# Altium schematic sheet QSFP.SchDoc: =ProjectName
size 420 x 297 mm; Author: T.P.; CompanyName: WUT; DrawnBy: T.P.; Organization: WUT ISE; Address1: Warsaw Univeristy of Technology; Address2: Nowowiejska 15/19; DocumentNumber: 20; Revision: 0.9; SheetNumber: 20; SheetTotal: 36; EDA_Number: ARTIQ; Projet: ARTIQ/SINARA; ModifiedBy: -; CreateDate: XX/XX/XXXX; CheckedDate: -; Title2: QSFP.SchDoc; DivGrp: ISE; Designer: G.K. and T.P.; ModifiedDate: -; ProjectName: ADC/DAC MEZZANINE
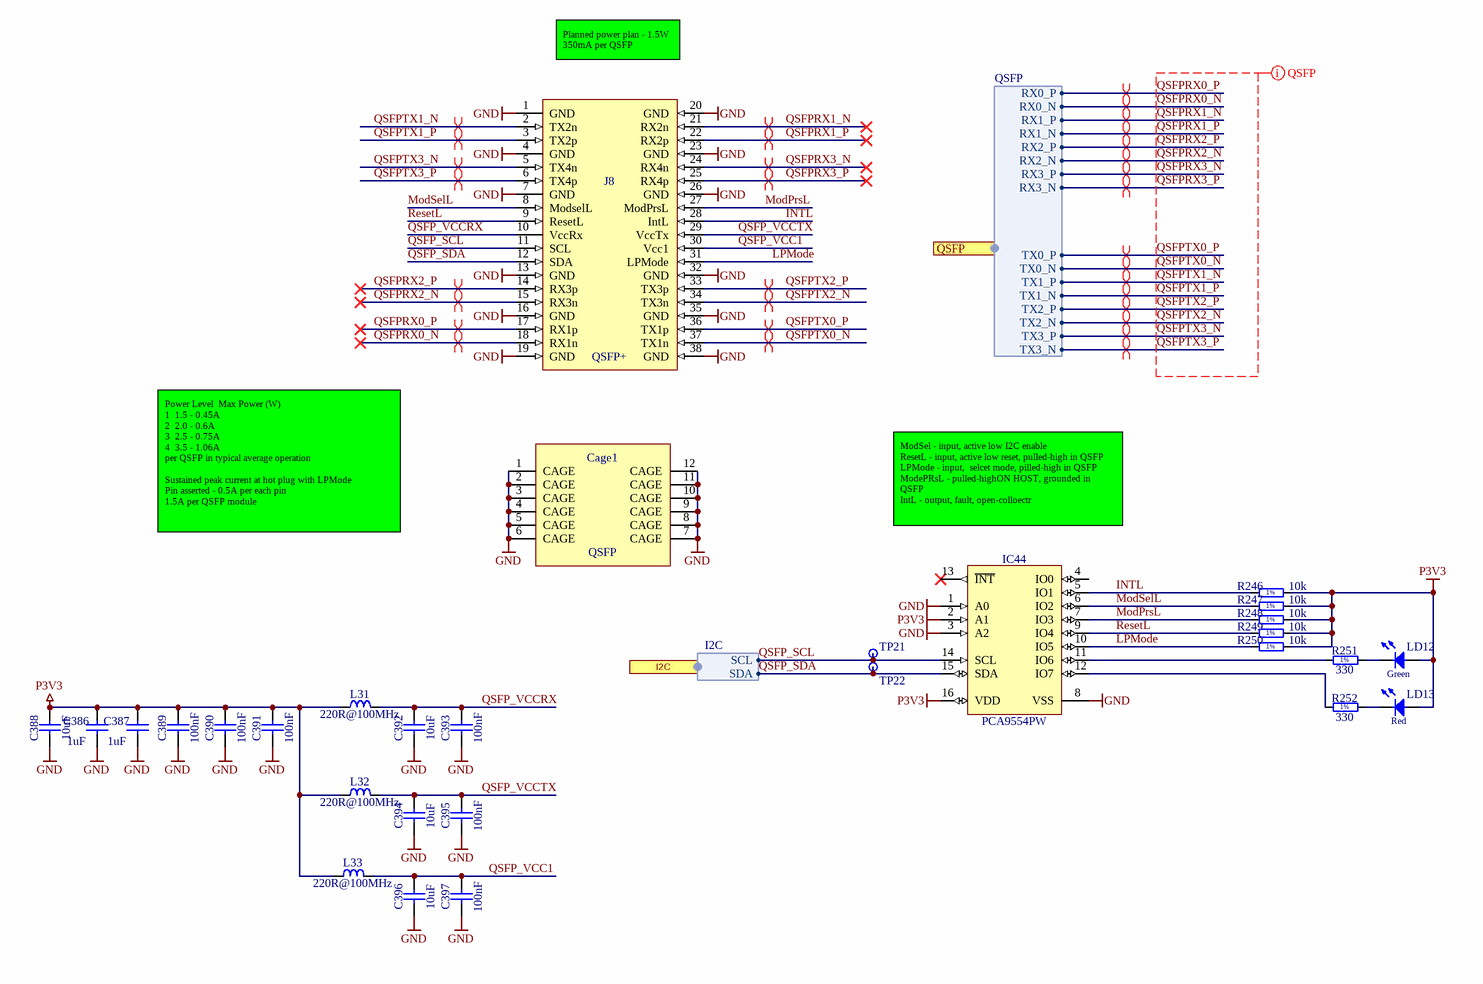
[diagram p0: QSFP.SchDoc]

## Parts
C386  1uF  [CAPC1005X55N]
C387  1uF  [CAPC1005X55N]
C388  10uF  [CAPC2012X135N]
C389  100nF  [CAPC1005X55N]
C390  100nF  [CAPC1005X55N]
C391  100nF  [CAPC1005X55N]
C392  10uF  [CAPC2012X135N]
C393  100nF  [CAPC1005X55N]
C394  10uF  [CAPC2012X135N]
C395  100nF  [CAPC1005X55N]
C396  10uF  [CAPC2012X135N]
C397  100nF  [CAPC1005X55N]
Cage1  QSFP  [TYCO_1888617-1]
IC44  PCA9554PW  [SOP65P640X110-16N]
J8  QSFP+  [TYCO_2110819-1]
L31  220R@100MHz  [INDC2012X105N]
L32  220R@100MHz  [INDC2012X105N]
L33  220R@100MHz  [INDC2012X105N]
LD12  Green  [LED_AVAGO_HSME-C120]
LD13  Red  [LED_AVAGO_HSMC-C120]
R246  10k  [RESC1005X40N]
R247  10k  [RESC1005X40N]
R248  10k  [RESC1005X40N]
R249  10k  [RESC1005X40N]
R250  10k  [RESC1005X40N]
R251  330  [RESC1005X40N]
R252  330  [RESC1005X40N]
TP21  Test Point  [TPS127]  (value not drawn)
TP22  Test Point  [TPS127]  (value not drawn)

## Ports
I2C (harness I2C), QSFP (harness QSFP)

## Harnesses
I2C: SCL, SDA
QSFP: RX0_P, RX0_N, RX1_P, RX1_N, RX2_P, RX2_N, RX3_P, RX3_N, TX0_P, TX0_N, TX1_P, TX1_N, TX2_P, TX2_N, TX3_P, TX3_N

## Nets
GND: C386.2 C387.2 C388.1 C389.1 C390.1 C391.1 C392.1 C393.1 C394.1 C395.1 C396.1 C397.1 Cage1.1(CAGE) Cage1.2(CAGE) Cage1.3(CAGE) Cage1.4(CAGE) Cage1.5(CAGE) Cage1.6(CAGE) Cage1.7(CAGE) Cage1.8(CAGE) Cage1.9(CAGE) Cage1.10(CAGE) Cage1.11(CAGE) Cage1.12(CAGE) IC44.1(A0) IC44.3(A2) IC44.8(VSS) J8.1(GND) J8.4(GND) J8.7(GND) J8.13(GND) J8.16(GND) J8.19(GND) J8.20(GND) J8.23(GND) J8.26(GND) J8.32(GND) J8.35(GND) J8.38(GND)
P3V3: C386.1 C387.1 C388.2 C389.2 C390.2 C391.2 IC44.2(A1) IC44.16(VDD) L31.1 L32.1 L33.1 LD12.2(A) LD13.2(A) R246.2 R247.2 R248.2 R249.2 R250.2
INTL: IC44.5(IO1) J8.28(IntL) R246.1
LPMode: IC44.10(IO5) J8.31(LPMode) R250.1
ModPrsL: IC44.7(IO3) J8.27(ModPrsL) R248.1
ModSelL: IC44.6(IO2) J8.8(ModselL) R247.1
QSFP_SCL: IC44.14(SCL) J8.11(SCL) TP21.1 ; port I2C.SCL
QSFP_SDA: IC44.15(SDA) J8.12(SDA) TP22.1 ; port I2C.SDA
QSFP_VCC1: C396.2 C397.2 J8.30(Vcc1) L33.2
QSFP_VCCRX: C392.2 C393.2 J8.10(VccRx) L31.2
QSFP_VCCTX: C394.2 C395.2 J8.29(VccTx) L32.2
QSFPRX0_N: J8.18(RX1n) ; port QSFP.RX0_N
QSFPRX0_P: J8.17(RX1p) ; port QSFP.RX0_P
QSFPRX1_N: J8.21(RX2n) ; port QSFP.RX1_P
QSFPRX1_P: J8.22(RX2p) ; port QSFP.RX1_N
QSFPRX2_N: J8.15(RX3n) ; port QSFP.RX2_N
QSFPRX2_P: J8.14(RX3p) ; port QSFP.RX2_P
QSFPRX3_N: J8.24(RX4n) ; port QSFP.RX3_P
QSFPRX3_P: J8.25(RX4p) ; port QSFP.RX3_N
QSFPTX0_N: J8.37(TX1n) ; port QSFP.TX0_N
QSFPTX0_P: J8.36(TX1p) ; port QSFP.TX0_P
QSFPTX1_N: J8.2(TX2n) ; port QSFP.TX1_P
QSFPTX1_P: J8.3(TX2p) ; port QSFP.TX1_N
QSFPTX2_N: J8.34(TX3n) ; port QSFP.TX2_N
QSFPTX2_P: J8.33(TX3p) ; port QSFP.TX2_P
QSFPTX3_N: J8.5(TX4n) ; port QSFP.TX3_P
QSFPTX3_P: J8.6(TX4p) ; port QSFP.TX3_N
ResetL: IC44.9(IO4) J8.9(ResetL) R249.1
NetIC44_11: IC44.11(IO6) R251.1
NetIC44_12: IC44.12(IO7) R252.1
NetLD12_1: LD12.1(C) R251.2
NetLD13_1: LD13.1(C) R252.2

Not connected (* = marked no-connect by the designer): IC44 4(IO0) 13(~{INT})*

## Layout directives
differential pair: QSFPRX0_N, QSFPRX0_P, QSFPRX1_N, QSFPRX1_P, QSFPRX2_N, QSFPRX2_P, QSFPRX3_N, QSFPRX3_P, QSFPTX0_N, QSFPTX0_P, QSFPTX1_N, QSFPTX1_P, QSFPTX2_N, QSFPTX2_P, QSFPTX3_N, QSFPTX3_P
differential pair; differential pair class Diff_100Ohm: QSFPRX0_N, QSFPRX0_P, QSFPRX1_N, QSFPRX1_P, QSFPRX2_N, QSFPRX2_P, QSFPRX3_N, QSFPRX3_P, QSFPTX0_N, QSFPTX0_P, QSFPTX1_N, QSFPTX1_P, QSFPTX2_N, QSFPTX2_P, QSFPTX3_N, QSFPTX3_P
mark named QSFP: QSFPRX0_N, QSFPRX0_P, QSFPRX1_N, QSFPRX1_P, QSFPRX2_N, QSFPRX2_P, QSFPRX3_N, QSFPRX3_P, QSFPTX0_N, QSFPTX0_P, QSFPTX1_N, QSFPTX1_P, QSFPTX2_N, QSFPTX2_P, QSFPTX3_N, QSFPTX3_P

## Notes on the sheet
- Planned power plan - 1.5W
  350mA per QSFP
- Power Level  Max Power (W)
  1  1.5 - 0.45A
  2  2.0 - 0.6A
  3  2.5 - 0.75A
  4  3.5 - 1.06A
  per QSFP in typical average operation
  Sustained peak current at hot plug with LPMode
  Pin asserted - 0.5A per each pin
  1.5A per QSFP module
- ModSel - input, active low I2C enable
  ResetL - input, active low reset, pulled-high in QSFP
  LPMode - input,  selcet mode, pilled-high in QSFP
  ModePRsL - pulled-highON HOST, grounded in QSFP
  IntL - output, fault, open-colloectr
- Project/Equipment
- Document
- Designer
- Drawn by
- Check.by
- File
- Last Mod.
- Print Date
- Sheet
- Size
- A3
- of
- Rev
- (in symbol R0402_10K_1%_0.0625W_100PPM) 1%
- (in symbol R0402_330R_1%_0.0625W_100PPM) 1%

## Library data of the parts
C386 C387 = CC0402_1UF_16V_10%_X5R: Non-polarised capacitor; Manufacturer: GENERIC; Part Description: SMD Multilayer Chip Ceramic Capacitor; Manufacturer1 Part Number: C1005X5R1C105KT; Tolerance: ±10%; Voltage: 16V; TC: X5R; Manufacturer Part Number: CC0402_1UF_16V_10%_X5R; Part Number: CC0402_1UF_16V_10%_X5R; Value: 1uF; Component Kind: Standard; Component Type: Standard; Pin Count: 2; Status: Preferred; Case: 0402; Mounted: Yes; Socket: No; SMD: Yes; Sense: No; Manufacturer1 Example: TDK; Manufacturer1 ComponentHeight: 0.55mm; HelpURL: \\cern.ch\dfs\Applications\Altium\Datasheets\CC0402_X5R_TDK_C.pdf; Author: CERN DEM JLC; CreateDate: 25.10.2012; LatestRevisionDate: 25.10.2012
C388 C392 C394 C396 = CC0805_10UF_10V_10%_X7R: Non-polarised capacitor; Part Description: SMD Multilayer Chip Ceramic Capacitor; Manufacturer: GENERIC; Manufacturer1 Part Number: GRM21BR71A106KE51L; Voltage: 10V; TC: X7R; Tolerance: ±10%; Part Number: CC0805_10UF_10V_10%_X7R; Component Kind: Standard; Component Type: Standard; Pin Count: 2; Value: 10uF; Status: Preferred; Manufacturer Part Number: CC0805_10UF_10V_10%_X7R; Case: 0805; Mounted: Yes; Socket: No; SMD: Yes; Sense: No; Manufacturer1 Example: MURATA; Manufacturer1 ComponentHeight: 1.35mm; HelpURL: \\cern.ch\dfs\Applications\Altium\Datasheets\CC0805_X7R_MURATA.pdf; Author: CERN DEM JLC; CreateDate: 30.04.2012; LatestRevisionDate: 30.04.2012
C389-C391 C393 C395 C397 = CC0402_100NF_16V_10%_X5R: Non-polarised capacitor; Part Description: SMD Multilayer Chip Ceramic Capacitor; Manufacturer: GENERIC; Manufacturer1 Part Number: GRM155R61C104KA88D; Voltage: 16V; TC: X5R; Tolerance: ±10%; Part Number: CC0402_100NF_16V_10%_X5R; Component Kind: Standard; Component Type: Standard; Pin Count: 2; Value: 100nF; Status: None; Manufacturer Part Number: CC0402_100NF_16V_10%_X5R; Case: 0402; Mounted: Yes; Socket: No; SMD: Yes; Sense: No; Manufacturer1 Example: MURATA; Manufacturer1 ComponentHeight: 0.55mm; HelpURL: \\cern.ch\dfs\Applications\Altium\Datasheets\CC0402_X5R_MURATA_GRM.pdf; Author: CERN DEM JLC; CreateDate: 10.12.2013; LatestRevisionDate: 10.12.2013
Cage1 = TYCO_1888617-1: QSFP 1x1 Cage (12Pins); Part Description: 1x1 Press Fit Cage For Use with QSFP Connector (Quad Small Form-factor Pluggable); Manufacturer: TYCO ELECTRONICS; Part Number: TYCO_1888617-1; Component Kind: Standard; Component Type: Standard; Pin Count: 12; Family: QSFP; Mounted: Yes; Socket: No; SMD: Yes; PressFit: Yes; Sense: No; Status: None; Manufacturer Part Number: 1888617-1; ComponentHeight: 9.7mm; HelpURL: \\cern.ch\dfs\Applications\Altium\Datasheets\TYCO_1888617-1.pdf; Author: CERN DEM JLC; CreateDate: 04.03.2014; LatestRevisionDate: 04.03.2014
IC44 = PCA9554PW: 8-Bit I2C-Bus and SMBus I/O Port with Interrupt; Manufacturer: NXP SEMICONDUCTORS; PressFit: No; Bonding: No; Part Number: PCA9554PW; Component Kind: Standard; Component Type: Standard; Device: PCA9554PW; PackageDescription: SOP, 0.65mm pitch; 16 pin, 4.40mm W X 5.00mm L X 1.10mm H body IPC Medium Density; Part Description: 8-Bit I2C-Bus and SMBus I/O Port with Interrupt; Manufacturer Part Number: PCA9554PW; Pin Count: 16; Case: TSSOP16; Mounted: Yes; Socket: No; SMD: Yes; Sense: No; ComponentHeight: 1.1mm; Author: CERN DEM JLC; HelpURL: \\cern.ch\dfs\Applications\Altium\Datasheets\PCA9554PW.pdf; CreateDate: 04.11.2014; LatestRevisionDate: 04.11.2014
J8 = TYCO_2110819-1: 38Position QSFP Connector  (Quad Small Form-factor Pluggable); Part Description: Surface Mount Enhanced EVERCLEAR Right Angle QSFP+ Host Connector; Manufacturer: TYCO ELECTRONICS; PressFit: No; Part Number: TYCO_2110819-1; Component Kind: Standard; Component Type: Standard; Pin Count: 38; Family: QSFP+; Mounted: Yes; Socket: No; SMD: No; Sense: No; Status: None; Manufacturer Part Number: 2110819-1; ComponentHeight: 5.48mm; HelpURL: \\cern.ch\dfs\Applications\Altium\Datasheets\TYCO_2110819-1.pdf; Author: CERN DEM JLC; CreateDate: 10.01.2018; LatestRevisionDate: 10.01.2018
L31-L33 = IND0805_MURATA_BLM21PG221SN1D: Inductor; Part Description: SMD EMIFIL Suppression Chip Ferrite Bead; Manufacturer: MURATA; Power: 2A; Resistance: 0.05R; Tolerance: ±25%; Part Number: IND0805_MURATA_BLM21PG221SN1D; Component Kind: Standard; Component Type: Standard; Pin Count: 2; Value: 220R@100MHz; Status: None; Manufacturer Part Number: BLM21PG221SN1D; Case: 0805; Mounted: Yes; Socket: No; SMD: Yes; Sense: No; ComponentHeight: 1.05mm; HelpURL: \\cern.ch\dfs\Applications\Altium\Datasheets\IND0805_MURATA_BLM21P.pdf; Author: CERN DEM JLC; CreateDate: 25.01.2010; LatestRevisionDate: 17.01.2017
LD12 = LED_AVAGO_HSME-C120: LED Green 1C 2A; Manufacturer: AVAGO TECHNOLOGIES; Part Description: High Performance Right Angle Chip Green LED; PressFit: No; Bonding: No; Manufacturer Part Number: HSME-C120; PackageDescription: Green Chip LED, 2-Leads, Body 1.7x1.1mm, Side Emitting Package; Part Number: LED_AVAGO_HSME-C120; Component Kind: Standard; Component Type: Standard; Color: Green; Pin Count: 2; Mounted: Yes; Socket: No; SMD: Yes; Sense: No; ComponentHeight: 0.7mm; HelpURL: \\cern.ch\dfs\Applications\Altium\Datasheets\LED_AVAGO_HSME-C120.pdf; ComponentLink1URL: \\cern.ch\dfs\Applications\Altium\Datasheets\LED_AVAGO_HSME-C110_DESIGN-GUIDE.pdf; ComponentLink1Description: Design Guide; Author: CERN DEM JMW; CreateDate: 22.07.2009; LatestRevisionDate: 20.06.2012
LD13 = LED_AVAGO_HSMC-C120: LED Red 1C 2A; Part Description: High Performance Right Angle Chip Red LED; Manufacturer: AVAGO TECHNOLOGIES; PressFit: No; Bonding: No; Part Number: LED_AVAGO_HSMC-C120; Component Kind: Standard; Component Type: Standard; Color: Red; PackageDescription: Red Chip LED, 2-Leads, Body 1.7x1.1mm, Side Emitting Package; Manufacturer Part Number: HSMC-C120; Pin Count: 2; Mounted: Yes; Socket: No; SMD: Yes; Sense: No; ComponentHeight: 0.7mm; HelpURL: \\cern.ch\dfs\Applications\Altium\Datasheets\LED_AVAGO_HSMC-C120.pdf; ComponentLink1URL: \\cern.ch\dfs\Applications\Altium\Datasheets\LED_AVAGO_HSMC-C120_DESIGN-GUIDE.pdf; ComponentLink1Description: Design Guide; Author: CERN DEM JMW; CreateDate: 22.07.2009; LatestRevisionDate: 20.06.2012
R246-R250 = R0402_10K_1%_0.0625W_100PPM: Resistor - 1%; Manufacturer: GENERIC; Part Description: General Purpose Thick Film Chip Resistor; Manufacturer1 Part Number: 232270671003L; TC: ±100ppm/°C; PressFit: No; Manufacturer Part Number: R0402_10K_1%_0.0625W_100PPM; Part Number: R0402_10K_1%_0.0625W_100PPM; Tolerance: ±1%; Value: 10k; Component Kind: Standard; Component Type: Standard; Pin Count: 2; Status: Not Recommended; Power: 0.0625W; Case: 0402; Mounted: Yes; Sense: No; Socket: No; SMD: Yes; Manufacturer1 Example: YAGEO PHYCOMP; Manufacturer1 ComponentHeight: 0.4mm; HelpURL: \\cern.ch\dfs\Applications\Altium\Datasheets\R0402_Phycomp_RC0402.pdf; Author: CERN DEM JLC; CreateDate: 03.12.2007; LatestRevisionDate: 17.10.2012
R251 R252 = R0402_330R_1%_0.0625W_100PPM: Resistor - 1%; Manufacturer: GENERIC; Part Description: General Purpose Thick Film Chip Resistor; Manufacturer1 Part Number: 232270673301L; TC: ±100ppm/°C; PressFit: No; Manufacturer Part Number: R0402_330R_1%_0.0625W_100PPM; Part Number: R0402_330R_1%_0.0625W_100PPM; Tolerance: ±1%; Value: 330; Component Kind: Standard; Component Type: Standard; Pin Count: 2; Status: Not Recommended; Power: 0.0625W; Case: 0402; Mounted: Yes; Sense: No; Socket: No; SMD: Yes; Manufacturer1 Example: YAGEO PHYCOMP; Manufacturer1 ComponentHeight: 0.4mm; HelpURL: \\cern.ch\dfs\Applications\Altium\Datasheets\R0402_Phycomp_RC0402.pdf; Author: CERN DEM JLC; CreateDate: 03.12.2007; LatestRevisionDate: 17.10.2012
TP21 TP22 = SMD_PAD_1.27X1.27MM: Part Description: 1.27mm x 1.27mm PCB Copper Area (SMD Test Point); Mounted: No; Part Number: SMD_PAD_1.27X1.27MM; Component Kind: Standard (No BOM); Component Type: Standard (No BOM); Pin Count: 1; Family: Test Point; Socket: No; SMD: Yes; Sense: No; Status: None; ComponentHeight: 0mm; HelpURL: Undefined; Author: CERN DEM JLC; CreateDate: 12.01.2008; LatestRevisionDate: 12.01.2008; PackageDescription: 1.27mm x 1.27mm PCB Copper Area (SMD Test Point)